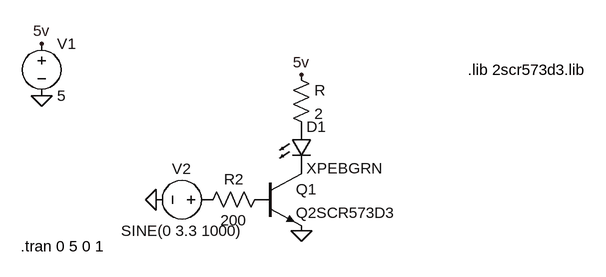
[diagram p0: schematic TX FINAL.asc]
TX FINAL.asc, the LTspice schematic file:
Version 4
SHEET 1 880 680
FLAG -176 -64 5v
FLAG -176 16 0
FLAG 224 -16 5v
FLAG 224 224 0
FLAG 0 176 0
SYMBOL LED 208 64 R0
SYMATTR InstName D1
SYMATTR Value XPEBGRN
SYMATTR Description Diode
SYMATTR Type diode
SYMBOL voltage -176 -80 R0
WINDOW 123 0 0 Left 0
WINDOW 39 0 0 Left 0
SYMATTR InstName V1
SYMATTR Value 5
SYMBOL res 208 -32 R0
SYMATTR InstName R
SYMATTR Value 2
SYMBOL npn 160 128 R0
SYMATTR InstName Q1
SYMATTR Value Q2SCR573D3
SYMBOL res 176 160 R90
WINDOW 0 0 56 VBottom 2
WINDOW 3 32 56 VTop 2
SYMATTR InstName R2
SYMATTR Value 200
SYMBOL voltage 96 176 R90
WINDOW 0 -32 56 VBottom 2
WINDOW 3 32 56 VTop 2
WINDOW 123 0 0 Left 0
WINDOW 39 0 0 Left 0
SYMATTR InstName V2
SYMATTR Value SINE(0 3.3 1000)
TEXT 480 -24 Left 2 !.lib 2scr573d3.lib
TEXT -208 248 Left 2 !.tran 0 5 0 1

The netlist it stands for:
* TX FINAL.asc
D1 P001 P002 XPEBGRN
V1 5v 0 5
R 5v P001 2
Q1 P002 P003 0 0 Q2SCR573D3
R2 P003 P004 200
V2 P004 0 SINE(0 3.3 1000)
.model D D
.lib standard.dio
.model NPN NPN
.model PNP PNP
.lib standard.bjt
.lib 2scr573d3.lib
.tran 0 5 0 1
.backanno
.end